# Altium project PIX_NANO.PrjPcb
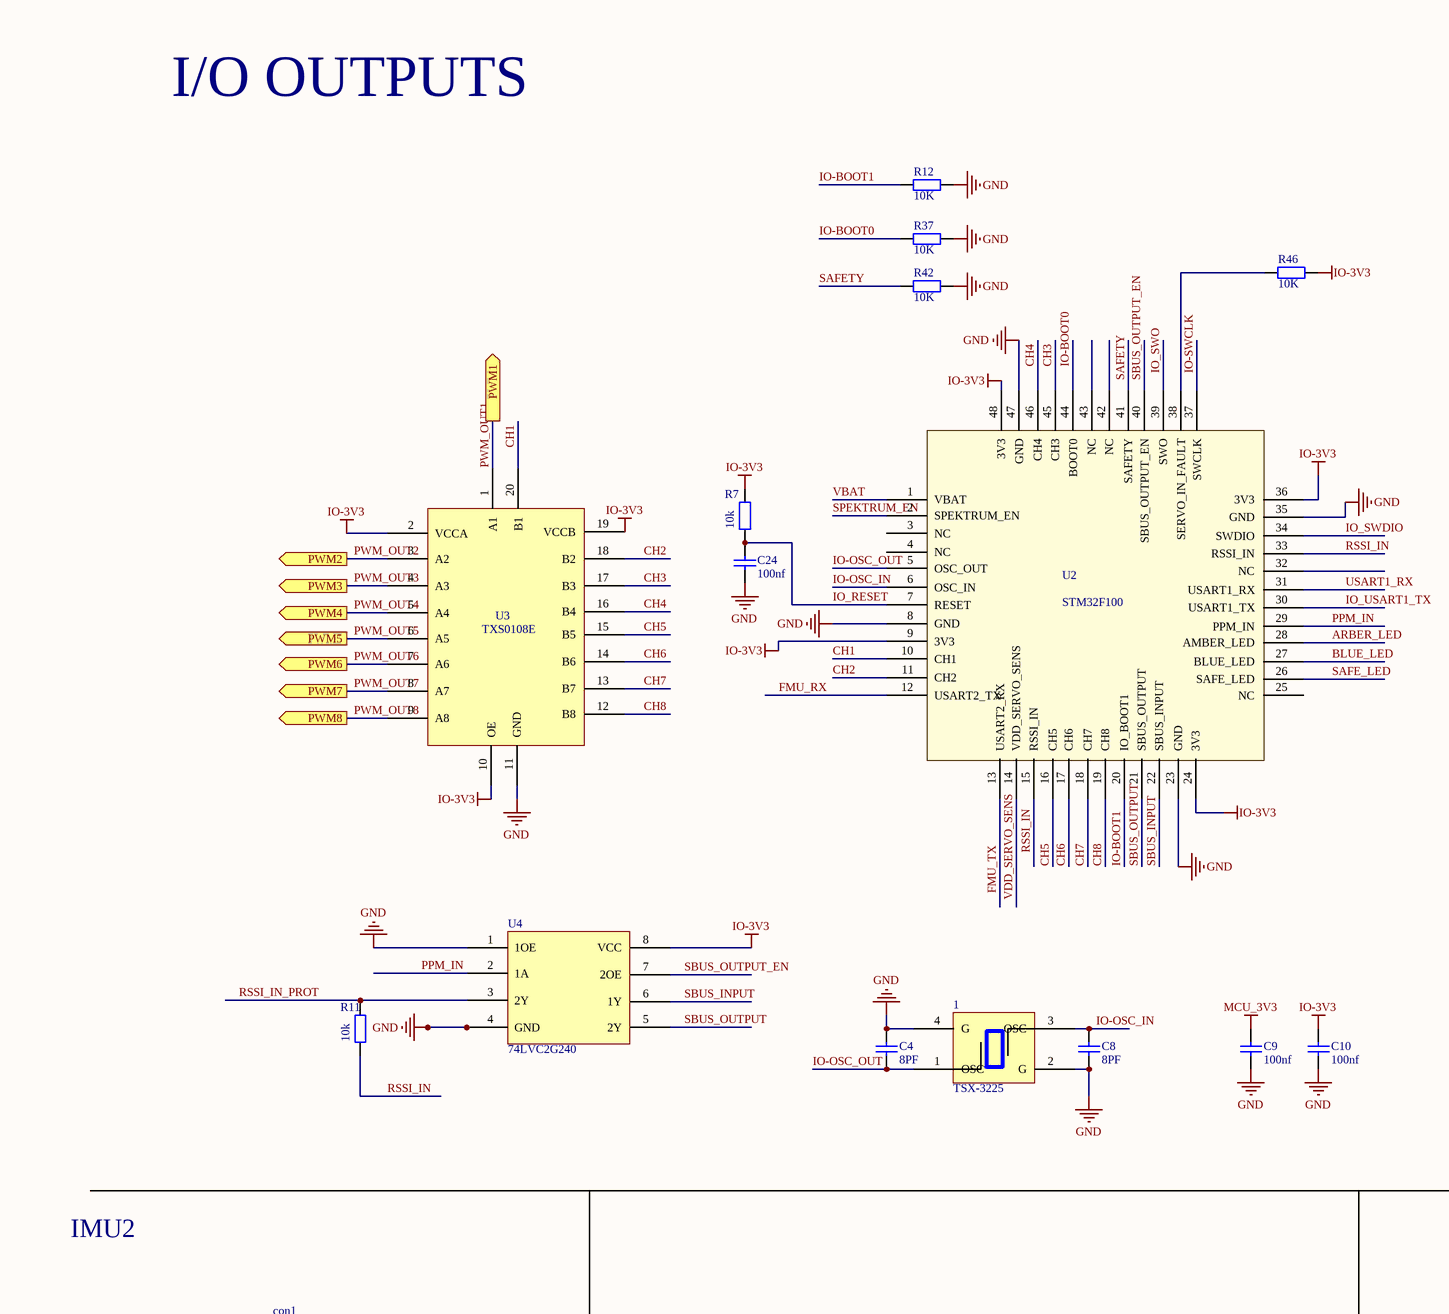
[diagram p0: PIX_NANO.SchDoc, top left]
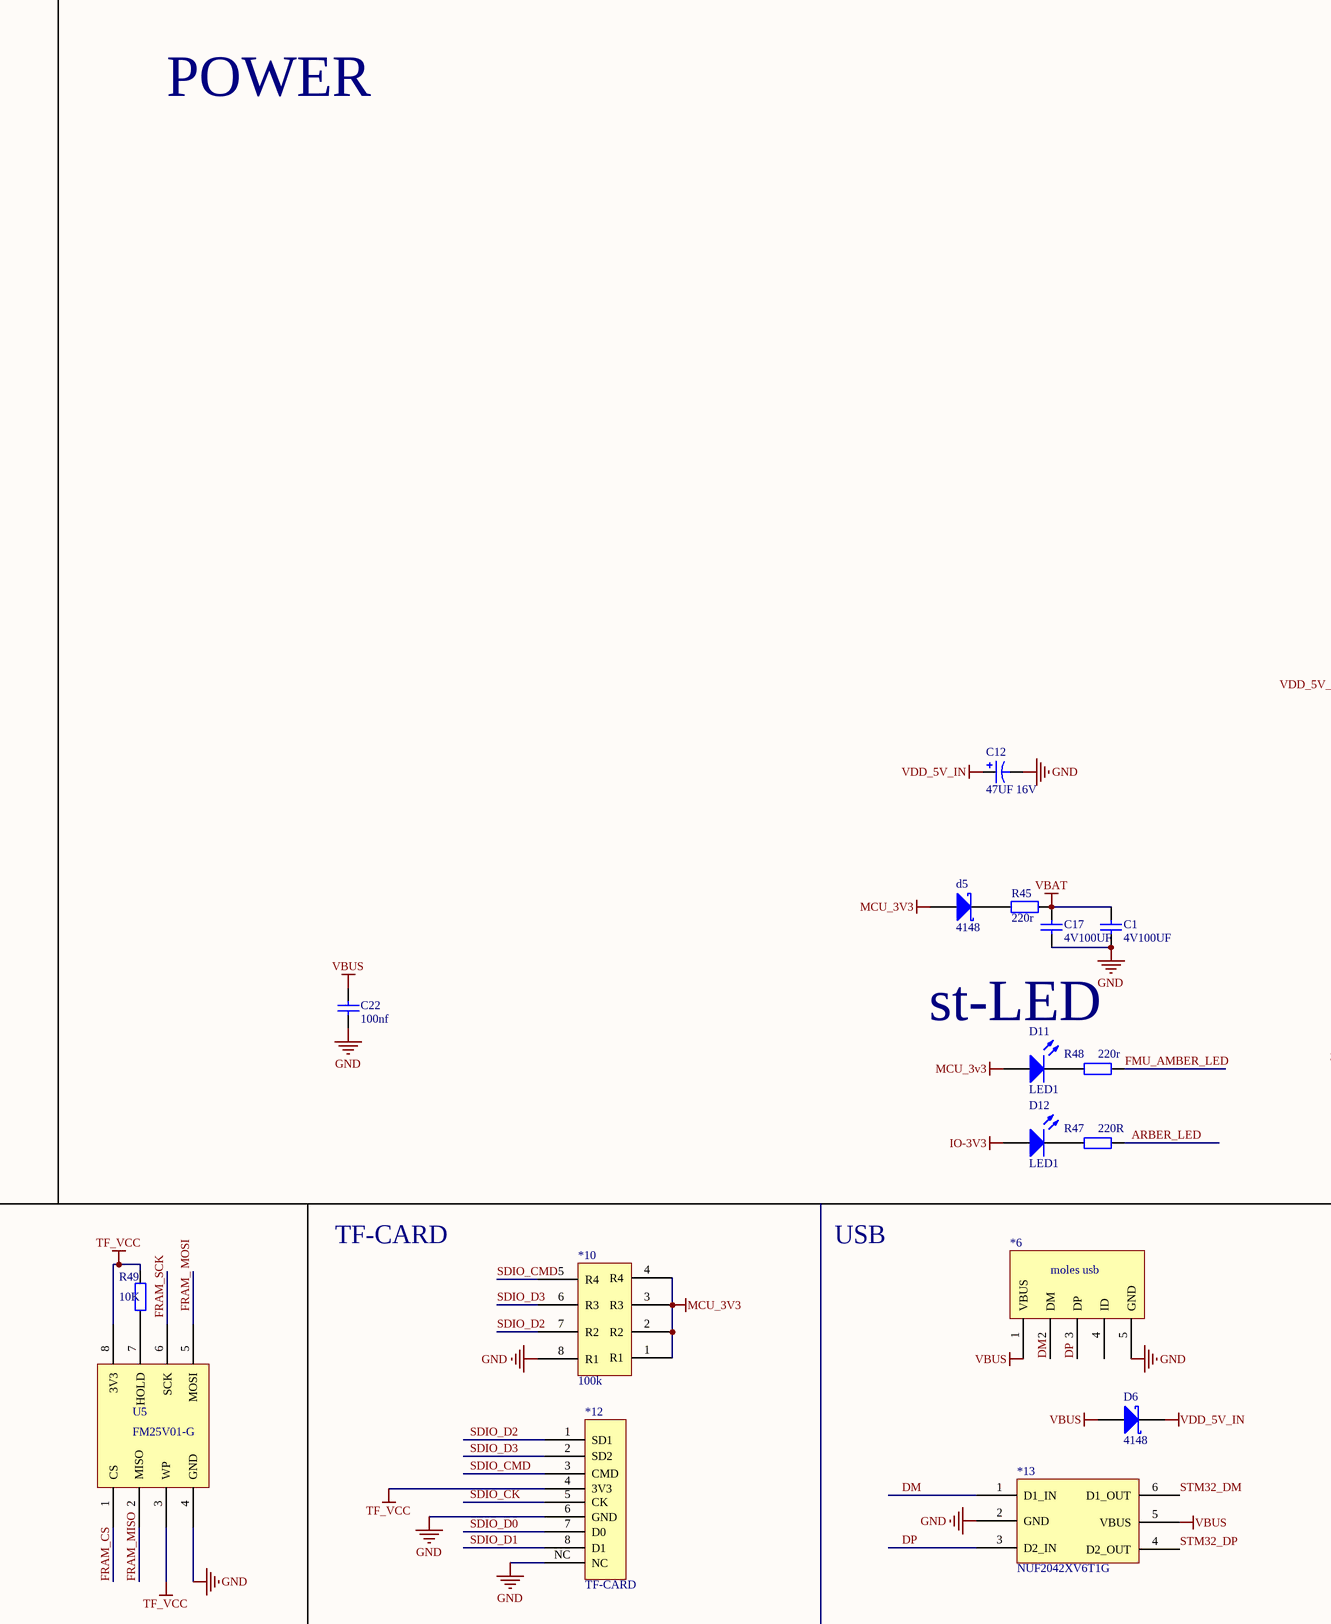
[diagram p1: PIX_NANO.SchDoc, top middle]
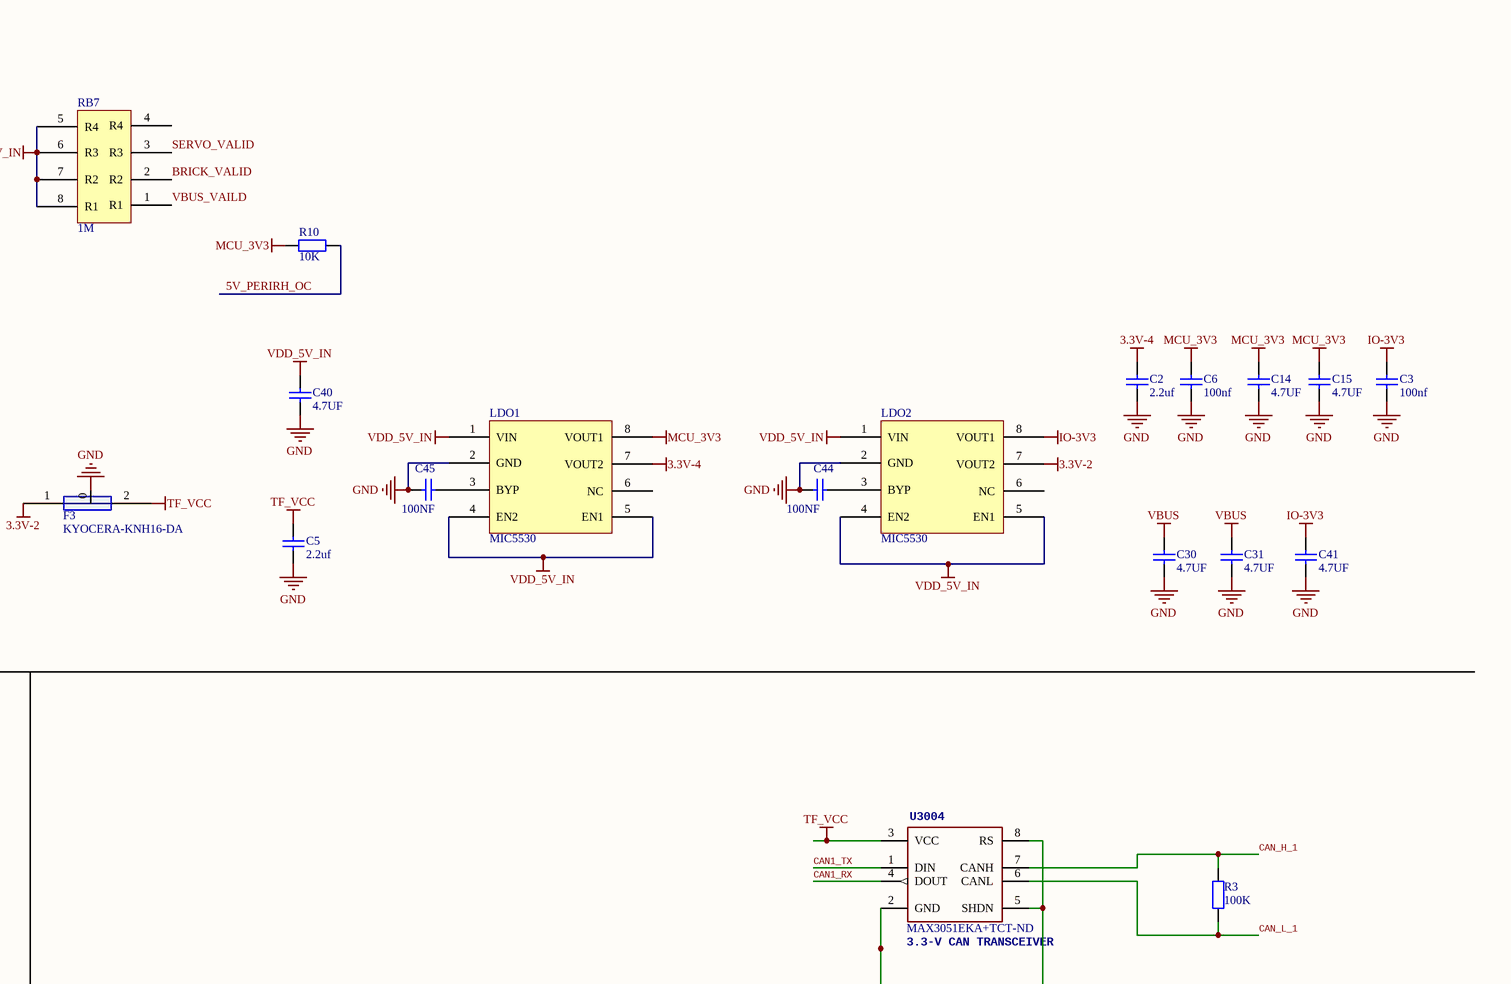
[diagram p2: PIX_NANO.SchDoc, top right]
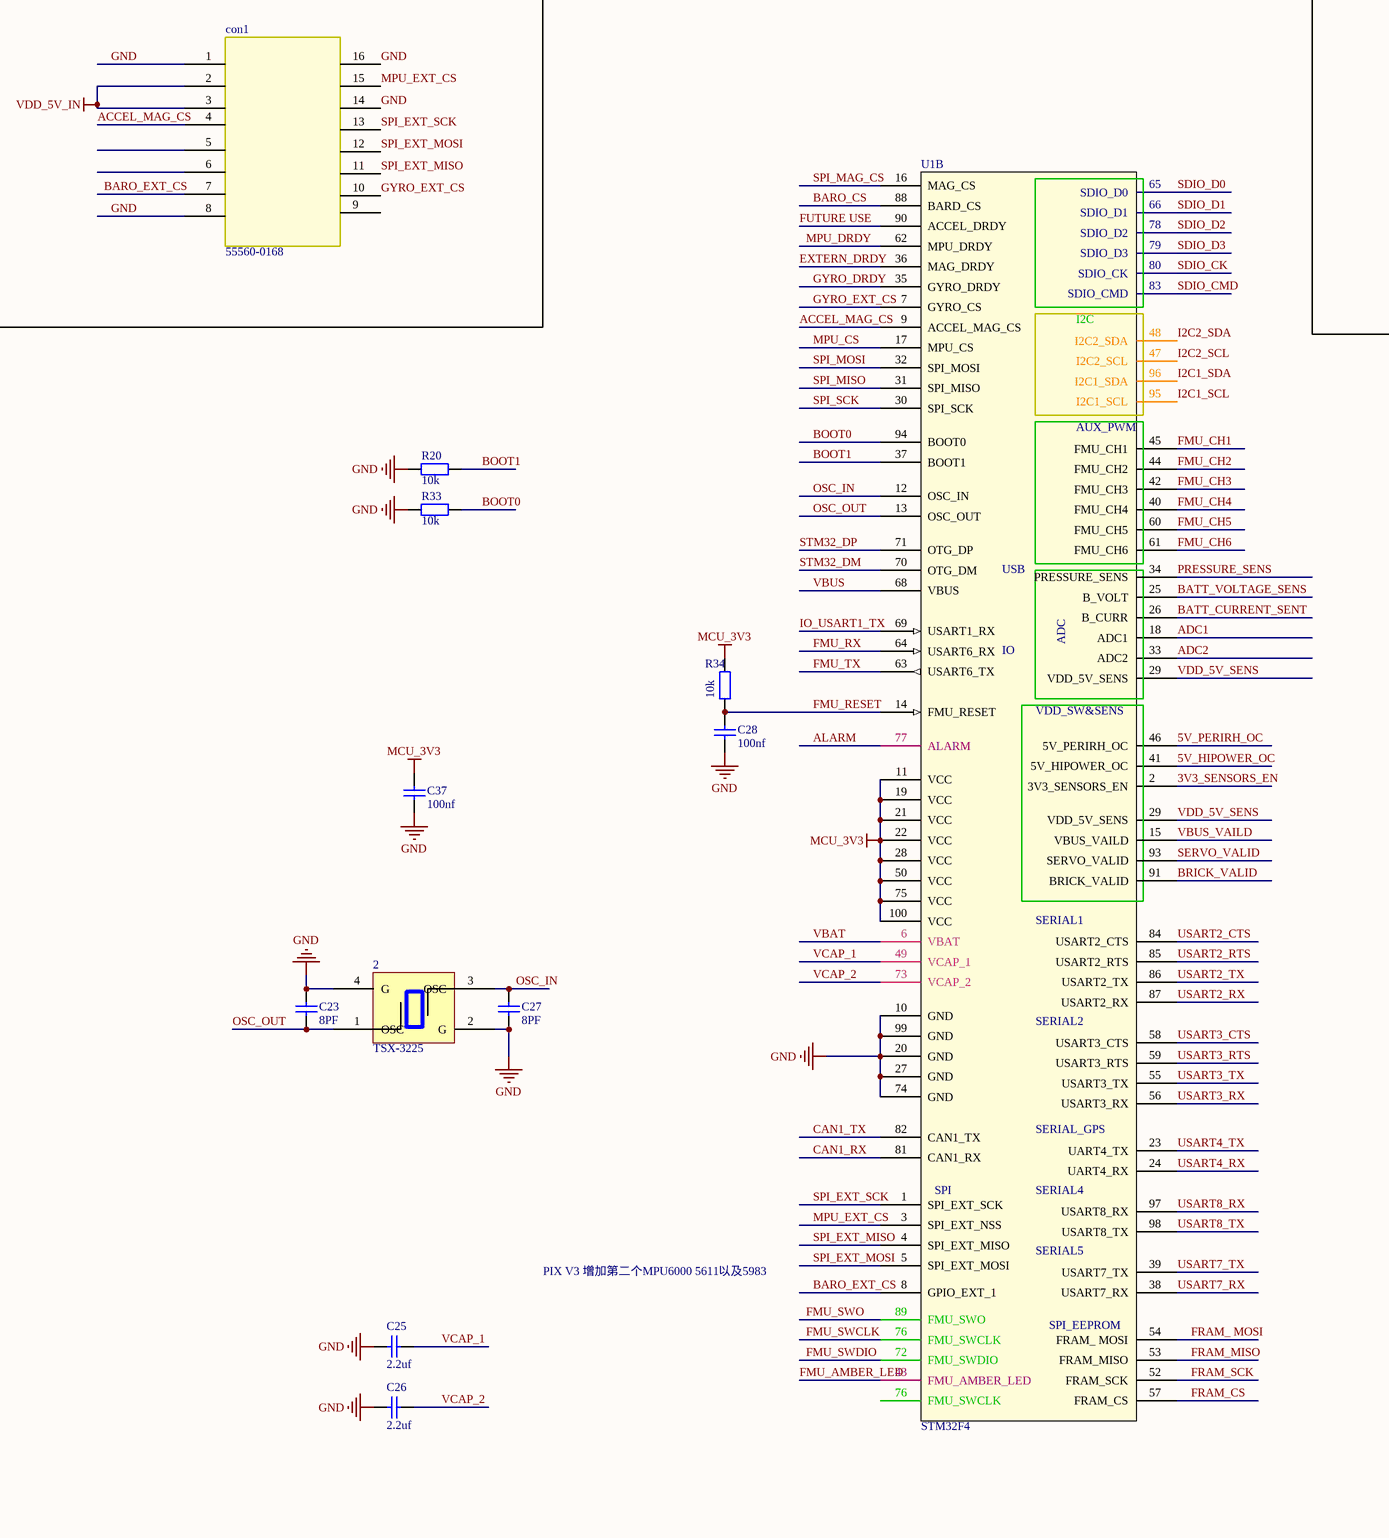
[diagram p3: PIX_NANO.SchDoc, bottom left]
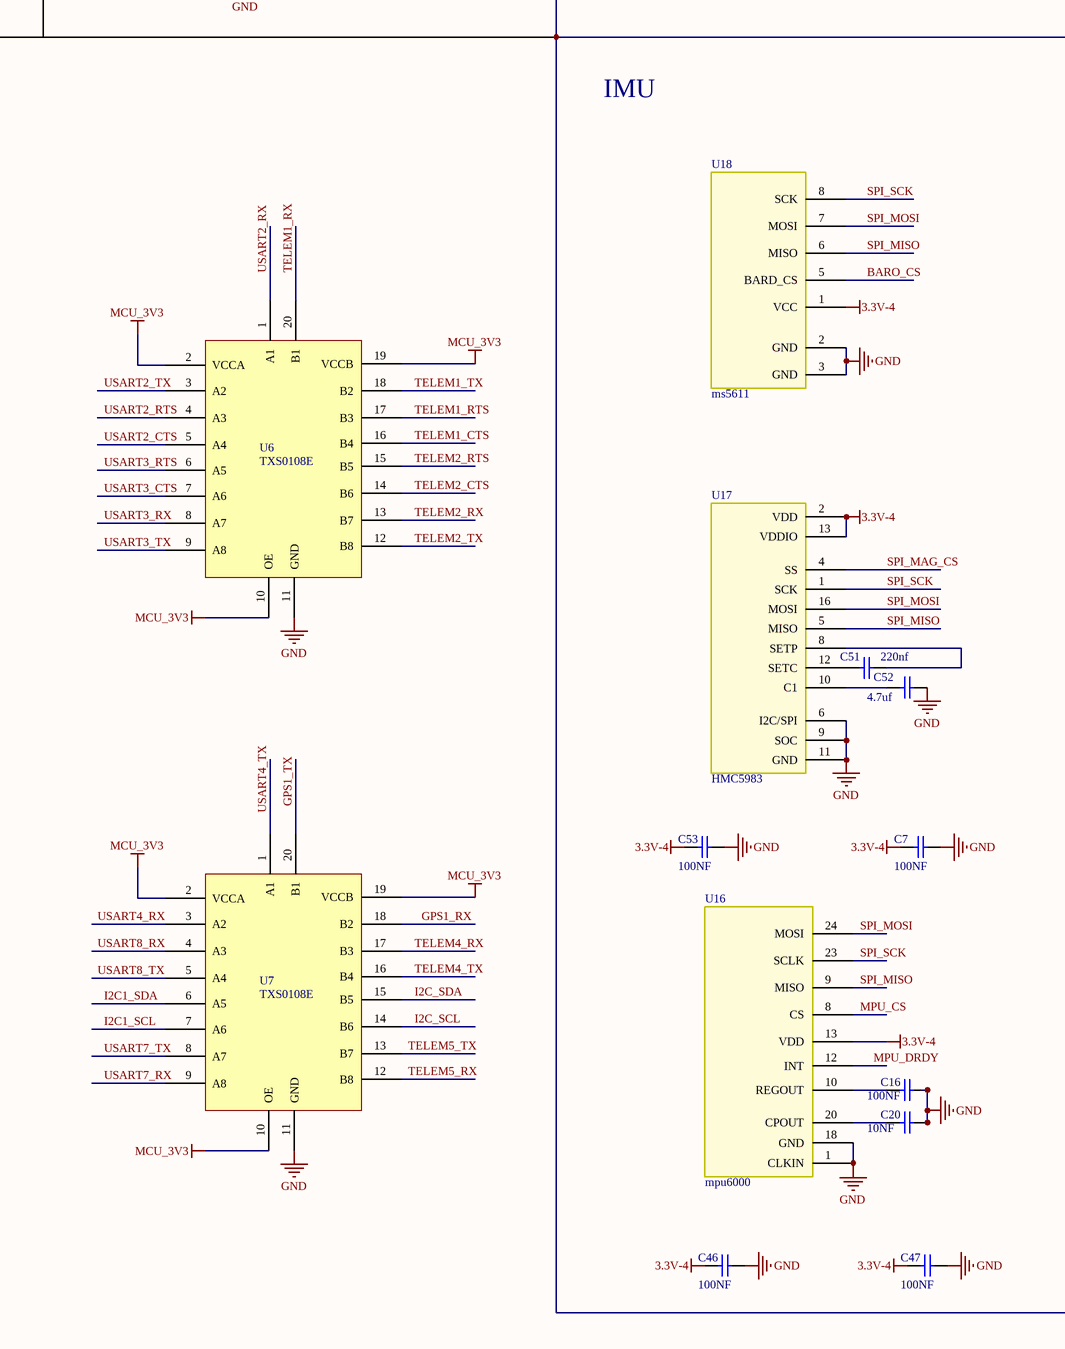
[diagram p4: PIX_NANO.SchDoc, bottom middle]
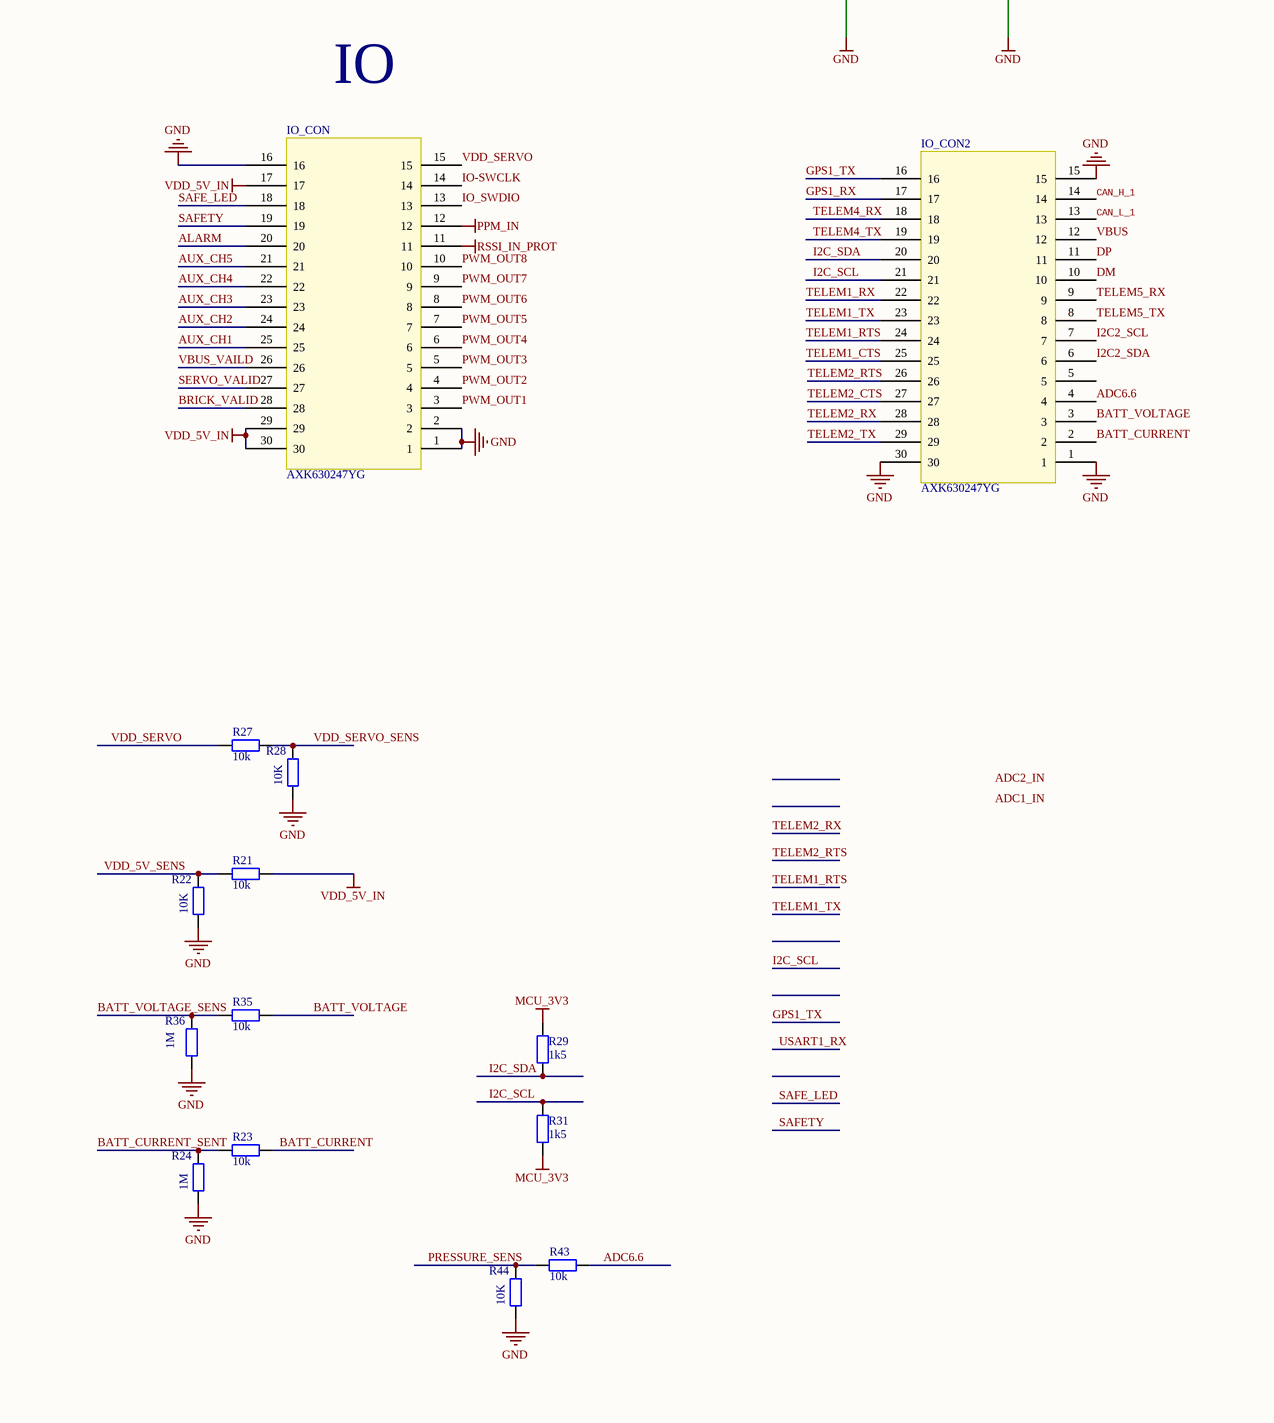
[diagram p5: PIX_NANO.SchDoc, bottom right]
1 sheet, 90 parts. Net scope: flat (ports and power ports of the same name join across sheets).
Board file: nano.PcbDoc

## Sheet PIX_NANO.SchDoc
size A1

### Parts
1  TSX-3225  [TSX-3225]
2  TSX-3225  [TSX-3225]
*6  moles usb  [moles usb]
*10  100k  [0402_4R]
*12  TF-CARD  [47352-1001]
*13  NUF2042XV6T1G  [SOT563-6]
C1  4V100UF  [0805CAP]
C2  2.2uf  [0402CAP]
C3  100nf  [0402CAP]
C4  8PF  [0402CAP]
C5  2.2uf  [0402CAP]
C6  100nf  [0402CAP]
C7  100NF  [0402CAP]
C8  8PF  [0402CAP]
C9  100nf  [0402CAP]
C10  100nf  [0402CAP]
C12  47UF 16V  [7343CAP]
C14  4.7UF  [0805CAP]
C15  4.7UF  [0805CAP]
C16  100NF  [0402CAP]
C17  4V100UF  [0805CAP]
C20  10NF  [0402CAP]
C22  100nf  [0402CAP]
C23  8PF  [0402CAP]
C24  100nf  [0402CAP]
C25  2.2uf  [0402CAP]
C26  2.2uf  [0402CAP]
C27  8PF  [0402CAP]
C28  100nf  [0402CAP]
C30  4.7UF  [0805CAP]
C31  4.7UF  [0805CAP]
C37  100nf  [0402CAP]
C40  4.7UF  [0805CAP]
C41  4.7UF  [0805CAP]
C44  100NF  [0402CAP]
C45  100NF  [0402CAP]
C46  100NF  [0402CAP]
C47  100NF  [0402CAP]
C51  220nf  [0402CAP]
C52  4.7uf  [0805cap]
C53  100NF  [0402CAP]
con1  55560-0168  [547220164]
d5  4148  [SOD323]
D6  4148  [SOD323]
D11  LED1  [0603-LED-YE]
D12  LED1  [0603-LED-YE]
F3  KYOCERA-KNH16-DA  [KYOCERA-KNH16-DA]
IO_CON  AXK630247YG  [AXK630247YG]
IO_CON2  AXK630247YG  [AXK630247YG]
LDO1  MIC5530  [MIC5530]
LDO2  MIC5530  [MIC5530]
R3  100K  [R0402]
R7  10k  [R0402]
R10  10K  [R0402]
R11  10k  [R0402]
R12  10K  [R0402]
R20  10k  [R0402]
R21  10k  [R0402]
R22  10K  [R0402]
R23  10k  [R0402]
R24  1M  [R0402]
R27  10k  [R0402]
R28  10K  [R0402]
R29  1k5  [R0402]
R31  1k5  [R0402]
R33  10k  [R0402]
R34  10k  [R0402]
R35  10k  [R0402]
R36  1M  [R0402]
R37  10K  [R0402]
R42  10K  [R0402]
R43  10k  [R0402]
R44  10K  [R0402]
R45  220r  [R0402]
R46  10K  [R0402]
R47  220R  [R0402]
R48  220r  [R0402]
R49  10K  [R0402]
RB7  1M  [0402_4R]
U1  STM32F4  [TQFP100_2]  (part B of 2)
U2  STM32F100  [TQFP48]
U3  TXS0108E  [QFN20-RGY]
U4  74LVC2G240  [TSSOP8 - duplicate]
U5  FM25V01-G  [SO-8]
U6  TXS0108E  [QFN20-RGY]
U7  TXS0108E  [QFN20-RGY]
U16  mpu6000  [MPU6000]
U17  HMC5983  [HMC5983]
U18  ms5611  [ms5611]
U3004  3.3-V CAN TRANSCEIVER  Supplier Part Number 1: MAX3051EKA+TCT-ND  [SOT23-8]

### Ports
PWM1 (out), PWM2 (out), PWM3 (out), PWM4 (out), PWM5 (out), PWM6 (out), PWM7 (out), PWM8 (out)

### Nets
3.3V-2: F3.1 LDO2.7(VOUT2)
3.3V-4: C2.2 C7.1 C46.1 C47.1 C53.1 LDO1.7(VOUT2) U16.13(VDD) U17.2(VDD) U17.13(VDDIO) U18.1(VCC)
GND: 1.2(G) 1.4(G) 2.2(G) 2.4(G) *6.5(GND) *10.8(R1) *12.6(GND) *12.NC *13.2(GND) C1.1 C2.1 C3.1 C4.2 C5.1 C6.1 C7.2 C8.1 C9.1 C10.1 C12.C C14.1 C15.1 C16.2 C17.1 C20.2 C22.1 C23.2 C24.1 C25.1 C26.1 C27.1 C28.1 C30.1 C31.1 C37.1 C40.1 C41.1 C44.2 C45.2 C46.2 C47.2 C52.2 C53.2 con1.1 con1.8 con1.14 con1.16 F3.0 IO_CON.1 IO_CON.2 IO_CON.16 IO_CON2.1 IO_CON2.15 IO_CON2.30 LDO1.2(GND) LDO2.2(GND) R12.1 R20.2 R22.1 R24.1 R28.1 R33.2 R36.1 R37.1 R42.1 R44.1 U1.10(GND) U1.20(GND) U1.27(GND) U1.74(GND) U1.99(GND) U2.8(GND) U2.23(GND) U2.35(GND) U2.47(GND) U3.11(GND) U4.1(1OE) U4.4(GND) U5.4(GND) U6.11(GND) U7.11(GND) U16.1(CLKIN) U16.18(GND) U17.6(I2C/SPI) U17.9(SOC) U17.11(GND) U18.2(GND) U18.3(GND) U3004.2(GND) U3004.5(SHDN) U3004.8(RS)
IO-3V3: C3.2 C10.2 C41.2 D12.1(A) LDO2.8(VOUT1) R7.2 R46.1 U2.9(3V3) U2.24(3V3) U2.36(3V3) U2.48(3V3) U3.2(VCCA) U3.10(OE) U3.19(VCCB) U4.8(VCC)
MCU_3V3: *10.1(R1) *10.2(R2) *10.3(R3) *10.4(R4) C6.2 C9.2 C14.2 C15.2 C37.2 d5.1 D11.1(A) LDO1.8(VOUT1) R10.1 R29.1 R31.1 R34.2 U1.11(VCC) U1.19(VCC) U1.21(VCC) U1.22(VCC) U1.28(VCC) U1.50(VCC) U1.75(VCC) U1.100(VCC) U6.2(VCCA) U6.10(OE) U6.19(VCCB) U7.2(VCCA) U7.10(OE) U7.19(VCCB)
PPM_IN: IO_CON.12 U2.29(PPM_IN) U4.2(1A)
RSSI_IN_PROT: IO_CON.11 R11.2 U4.3(2Y)
TF_VCC: *12.4(3V3) C5.2 F3.2 R49.1 U5.3(WP) U5.8(3V3) U3004.3(VCC)
VBAT: C1.2 C17.2 R45.2 U1.6(VBAT) U2.1(VBAT)
VBUS: *6.1(VBUS) *13.5(VBUS) C22.2 C30.2 C31.2 D6.1 IO_CON2.12 U1.68(VBUS)
VDD_5V_IN: C12.A C40.2 con1.2 con1.3 D6.2 IO_CON.17 IO_CON.29 IO_CON.30 LDO1.1(VIN) LDO1.4(EN2) LDO1.5(EN1) LDO2.1(VIN) LDO2.4(EN2) LDO2.5(EN1) R21.2 RB7.5(R4) RB7.6(R3) RB7.7(R2) RB7.8(R1)
3V3_SENSORS_EN: U1.2(3V3_SENSORS_EN)
5V_HIPOWER_OC: U1.41(5V_HIPOWER_OC)
5V_PERIRH_OC: R10.2 U1.46(5V_PERIRH_OC)
ACCEL_MAG_CS: con1.4 U1.9(ACCEL_MAG_CS)
ADC1: U1.18(ADC1)
ADC2: U1.33(ADC2)
ADC6.6: IO_CON2.4 R43.2
ALARM: IO_CON.20 U1.77(ALARM)
ARBER_LED: R47.2 U2.28(AMBER_LED)
AUX_CH1: IO_CON.25
AUX_CH2: IO_CON.24
AUX_CH3: IO_CON.23
AUX_CH4: IO_CON.22
AUX_CH5: IO_CON.21
BARO_CS: U1.88(BARD_CS) U18.5(BARD_CS)
BARO_EXT_CS: con1.7 U1.8(GPIO_EXT_1)
BATT_CURRENT: IO_CON2.2 R23.2
BATT_CURRENT_SENT: R23.1 R24.2 U1.26(B_CURR)
BATT_VOLTAGE: IO_CON2.3 R35.2
BATT_VOLTAGE_SENS: R35.1 R36.2 U1.25(B_VOLT)
BLUE_LED: U2.27(BLUE_LED)
BOOT0: R33.1 U1.94(BOOT0)
BOOT1: R20.1 U1.37(BOOT1)
BRICK_VALID: IO_CON.28 RB7.2(R2) U1.91(BRICK_VALID)
CAN1_RX: U1.81(CAN1_RX) U3004.4(DOUT)
CAN1_TX: U1.82(CAN1_TX) U3004.1(DIN)
CAN_H_1: IO_CON2.14 R3.1 U3004.7(CANH)
CAN_L_1: IO_CON2.13 R3.2 U3004.6(CANL)
CH1: U2.10(CH1) U3.20(B1)
CH2: U2.11(CH2) U3.18(B2)
CH3: U2.45(CH3) U3.17(B3)
CH4: U2.46(CH4) U3.16(B4)
CH5: U2.16(CH5) U3.15(B5)
CH6: U2.17(CH6) U3.14(B6)
CH7: U2.18(CH7) U3.13(B7)
CH8: U2.19(CH8) U3.12(B8)
DM: *6.2(DM) *13.1(D1_IN) IO_CON2.10
DP: *6.3(DP) *13.3(D2_IN) IO_CON2.11
EXTERN_DRDY: U1.36(MAG_DRDY)
FMU_AMBER_LED: R48.2 U1.43(FMU_AMBER_LED)
FMU_CH1: U1.45(FMU_CH1)
FMU_CH2: U1.44(FMU_CH2)
FMU_CH3: U1.42(FMU_CH3)
FMU_CH4: U1.40(FMU_CH4)
FMU_CH5: U1.60(FMU_CH5)
FMU_CH6: U1.61(FMU_CH6)
FMU_RESET: C28.2 R34.1 U1.14(FMU_RESET)
FMU_RX: U1.64(USART6_RX) U2.12(USART2_TX)
FMU_SWCLK: U1.76(FMU_SWCLK)
FMU_SWDIO: U1.72(FMU_SWDIO)
FMU_SWO: U1.89(FMU_SWO)
FMU_TX: U1.63(USART6_TX) U2.13(USART2_RX)
FRAM_ MOSI: U1.54(FRAM__MOSI) U5.5(MOSI)
FRAM_CS: U1.57(FRAM_CS) U5.1(CS)
FRAM_MISO: U1.53(FRAM_MISO) U5.2(MISO)
FRAM_SCK: U1.52(FRAM_SCK) U5.6(SCK)
FUTURE USE: U1.90(ACCEL_DRDY)
GPS1_RX: IO_CON2.17 U7.18(B2)
GPS1_TX: IO_CON2.16 U7.20(B1)
GYRO_DRDY: U1.35(GYRO_DRDY)
GYRO_EXT_CS: con1.10 U1.7(GYRO_CS)
I2C1_SCL: U1.95(I2C1_SCL) U7.7(A6)
I2C1_SDA: U1.96(I2C1_SDA) U7.6(A5)
I2C2_SCL: IO_CON2.7 U1.47(I2C2_SCL)
I2C2_SDA: IO_CON2.6 U1.48(I2C2_SDA)
I2C_SCL: IO_CON2.21 R31.2 U7.14(B6)
I2C_SDA: IO_CON2.20 R29.2 U7.15(B5)
IO-BOOT0: R37.2 U2.44(BOOT0)
IO-BOOT1: R12.2 U2.20(IO_BOOT1)
IO-OSC_IN: 1.3(OSC) C8.2 U2.6(OSC_IN)
IO-OSC_OUT: 1.1(OSC) C4.1 U2.5(OSC_OUT)
IO-SWCLK: IO_CON.14 U2.37(SWCLK)
IO_RESET: C24.2 R7.1 U2.7(RESET)
IO_SWDIO: IO_CON.13 U2.34(SWDIO)
IO_SWO: U2.39(SWO)
IO_USART1_TX: U1.69(USART1_RX) U2.30(USART1_TX)
MPU_CS: U1.17(MPU_CS) U16.8(CS)
MPU_DRDY: U1.62(MPU_DRDY) U16.12(INT)
MPU_EXT_CS: con1.15 U1.3(SPI_EXT_NSS)
OSC_IN: 2.3(OSC) C27.2 U1.12(OSC_IN)
OSC_OUT: 2.1(OSC) C23.1 U1.13(OSC_OUT)
PRESSURE_SENS: R43.1 R44.2 U1.34(PRESSURE_SENS)
PWM_OUT1: IO_CON.3 U3.1(A1) ; port PWM1
PWM_OUT2: IO_CON.4 U3.3(A2) ; port PWM2
PWM_OUT3: IO_CON.5 U3.4(A3) ; port PWM3
PWM_OUT4: IO_CON.6 U3.5(A4) ; port PWM4
PWM_OUT5: IO_CON.7 U3.6(A5) ; port PWM5
PWM_OUT6: IO_CON.8 U3.7(A6) ; port PWM6
PWM_OUT7: IO_CON.9 U3.8(A7) ; port PWM7
PWM_OUT8: IO_CON.10 U3.9(A8) ; port PWM8
RSSI_IN: R11.1 U2.15(RSSI_IN) U2.33(RSSI_IN)
SAFE_LED: IO_CON.18 U2.26(SAFE_LED)
SAFETY: IO_CON.19 R42.2 U2.41(SAFETY)
SBUS_INPUT: U2.22(SBUS_INPUT) U4.6(1Y)
SBUS_OUTPUT: U2.21(SBUS_OUTPUT) U4.5(2Y)
SBUS_OUTPUT_EN: U2.40(SBUS_OUTPUT_EN) U4.7(2OE)
SDIO_CK: *12.5(CK) U1.80(SDIO_CK)
SDIO_CMD: *10.5(R4) *12.3(CMD) U1.83(SDIO_CMD)
SDIO_D0: *12.7(D0) U1.65(SDIO_D0)
SDIO_D1: *12.8(D1) U1.66(SDIO_D1)
SDIO_D2: *10.7(R2) *12.1(SD1) U1.78(SDIO_D2)
SDIO_D3: *10.6(R3) *12.2(SD2) U1.79(SDIO_D3)
SERVO_VALID: IO_CON.27 RB7.3(R3) U1.93(SERVO_VALID)
SPEKTRUM_EN: U2.2(SPEKTRUM_EN)
SPI_EXT_MISO: con1.11 U1.4(SPI_EXT_MISO)
SPI_EXT_MOSI: con1.12 U1.5(SPI_EXT_MOSI)
SPI_EXT_SCK: con1.13 U1.1(SPI_EXT_SCK)
SPI_MAG_CS: U1.16(MAG_CS) U17.4(SS)
SPI_MISO: U1.31(SPI_MISO) U16.9(MISO) U17.5(MISO) U18.6(MISO)
SPI_MOSI: U1.32(SPI_MOSI) U16.24(MOSI) U17.16(MOSI) U18.7(MOSI)
SPI_SCK: U1.30(SPI_SCK) U16.23(SCLK) U17.1(SCK) U18.8(SCK)
STM32_DM: *13.6(D1_OUT) U1.70(OTG_DM)
STM32_DP: *13.4(D2_OUT) U1.71(OTG_DP)
TELEM1_CTS: IO_CON2.25 U6.16(B4)
TELEM1_RTS: IO_CON2.24 U6.17(B3)
TELEM1_RX: IO_CON2.22 U6.20(B1)
TELEM1_TX: IO_CON2.23 U6.18(B2)
TELEM2_CTS: IO_CON2.27 U6.14(B6)
TELEM2_RTS: IO_CON2.26 U6.15(B5)
TELEM2_RX: IO_CON2.28 U6.13(B7)
TELEM2_TX: IO_CON2.29 U6.12(B8)
TELEM4_RX: IO_CON2.18 U7.17(B3)
TELEM4_TX: IO_CON2.19 U7.16(B4)
TELEM5_RX: IO_CON2.9 U7.12(B8)
TELEM5_TX: IO_CON2.8 U7.13(B7)
USART1_RX: U2.31(USART1_RX)
USART2_CTS: U1.84(USART2_CTS) U6.5(A4)
USART2_RTS: U1.85(USART2_RTS) U6.4(A3)
USART2_RX: U1.87(USART2_RX) U6.1(A1)
USART2_TX: U1.86(USART2_TX) U6.3(A2)
USART3_CTS: U1.58(USART3_CTS) U6.7(A6)
USART3_RTS: U1.59(USART3_RTS) U6.6(A5)
USART3_RX: U1.56(USART3_RX) U6.8(A7)
USART3_TX: U1.55(USART3_TX) U6.9(A8)
USART4_RX: U1.24(UART4_RX) U7.3(A2)
USART4_TX: U1.23(UART4_TX) U7.1(A1)
USART7_RX: U1.38(USART7_RX) U7.9(A8)
USART7_TX: U1.39(USART7_TX) U7.8(A7)
USART8_RX: U1.97(USART8_RX) U7.4(A3)
USART8_TX: U1.98(USART8_TX) U7.5(A4)
VBUS_VAILD: IO_CON.26 RB7.1(R1) U1.15(VBUS_VAILD)
VCAP_1: C25.2 U1.49(VCAP_1)
VCAP_2: C26.2 U1.73(VCAP_2)
VDD_5V_SENS: R21.1 R22.2 U1.29(VDD_5V_SENS)
VDD_SERVO: IO_CON.15 R27.1
VDD_SERVO_SENS: R27.2 R28.2 U2.14(VDD_SERVO_SENS)
NetC16_1: C16.1 U16.10(REGOUT)
NetC20_1: C20.1 U16.20(CPOUT)
NetC44_1: C44.1 LDO2.3(BYP)
NetC45_1: C45.1 LDO1.3(BYP)
NetC51_1: C51.1 U17.12(SETC)
NetC51_2: C51.2 U17.8(SETP)
NetC52_1: C52.1 U17.10(C1)
Netd5_2: d5.2 R45.1
NetD11_2: D11.2(K) R48.1
NetD12_2: D12.2(K) R47.1
NetR46_2: R46.2 U2.38(SERVO_IN_FAULT)
NetR49_2: R49.2 U5.7(HOLD)

Not connected (* = marked no-connect by the designer): *6 4(ID); con1 5 6 9; IO_CON2 5; LDO1 6(NC); LDO2 6(NC); RB7 4(R4); U2 3(NC) 4(NC) 25(NC) 32(NC) 42(NC) 43(NC)

### Notes on the sheet
- I/O OUTPUTS
- POWER
- st-LED
- IMU2
- TF-CARD
- USB
- IO
- IMU
- PIX V3 增加第二个MPU6000 5611以及5983
- Labels drawn without touching a wire or pin: ADC1_IN, ADC2_IN
- Title
- Size:
- Date:
- File:
- A1
- Number:
- Time:
- Revision:
- Sheet
- of
- (in symbol STM32F4, part B) I2C; AUX_PWM; USB; ADC; IO; VDD_SW&SENS; SERIAL1; SERIAL2; SERIAL_GPS; SPI; SERIAL4; SERIAL5; SPI_EEPROM

### Library data of the parts
*10 RB7 = 0402_4R
*12 = 47352-1001
C1-C6 C8-C10 C14 C15 C17 C22-C28 C30 C31 C37 C40 C41 C44 C45 = Cap: Value: 100pF; Published: 8-Jun-2000; LatestRevisionDate: 17-Jul-2002; LatestRevisionNote: Re-released for DXP Platform.; PackageReference: RAD-0.3; Publisher: Altium Limited; PackageDescription: Radial Cap, Thru-Hole; 2 Leads; 0.3 in Pin Spacing
C7 C16 C20 C46 C47 C51-C53 = Cap: Capacitor; Value: 100pF; Published: 8-Jun-2000; LatestRevisionDate: 17-Jul-2002; LatestRevisionNote: Re-released for DXP Platform.; PackageReference: RAD-0.3; Publisher: Altium Limited; PackageDescription: Radial Cap, Thru-Hole; 2 Leads; 0.3 in Pin Spacing
C12 = Cap Pol1: Polarized Capacitor (Radial); Value: 100pF; Published: 8-Jun-2000; LatestRevisionDate: 17-Jul-2002; LatestRevisionNote: Re-released for DXP Platform.; PackageReference: RB7.6-15; Publisher: Altium Limited; PackageDescription: Polarized Capacitor (Radial); 2 Leads
d5 D6 = D Schottky: Schottky Diode; Published: 8-Jun-2000; LatestRevisionDate: 17-Jul-2002; LatestRevisionNote: Re-released for DXP Platform.; PackageReference: SMB; Publisher: Altium Limited; PackageDescription: DO-214-AA/SMB; 2 C-Bend Leads; Body 5.3 x 3.6 mm, inc. leads (LxW); Code_JEDEC: DO-214-AA
D11 D12 = LED1: Typical RED GaAs LED; Published: 8-Jun-2000; LatestRevisionDate: 08-Jul-2005; LatestRevisionNote: Mech Layer 1 removed.; PackageReference: LED-1; Publisher: Altium Limited; PackageDescription: LED; 2 Leads
IO_CON IO_CON2 = AXK630247YG\
R3 R7 R10-R12 R20-R24 R27-R29 R31 R33-R37 R42-R49 = Res2: Resistor; Value: 1K; Published: 8-Jun-2000; LatestRevisionDate: 17-Jul-2002; LatestRevisionNote: Re-released for DXP Platform.; PackageReference: AXIAL-0.4; Publisher: Altium Limited; PackageDescription: Axial Device, Thru-Hole; 2 Leads; 0.4 in Pin Spacing
U5 = Component_1
U3004 = MAX3051MAX3051EKA: IC TXRX CAN 1MBPS SOT23-8; 3DR_PARTNO: ECM0831; PARTNO: MAX3051EKA+T; Supplier 1: Digi-Key; Value: CAN